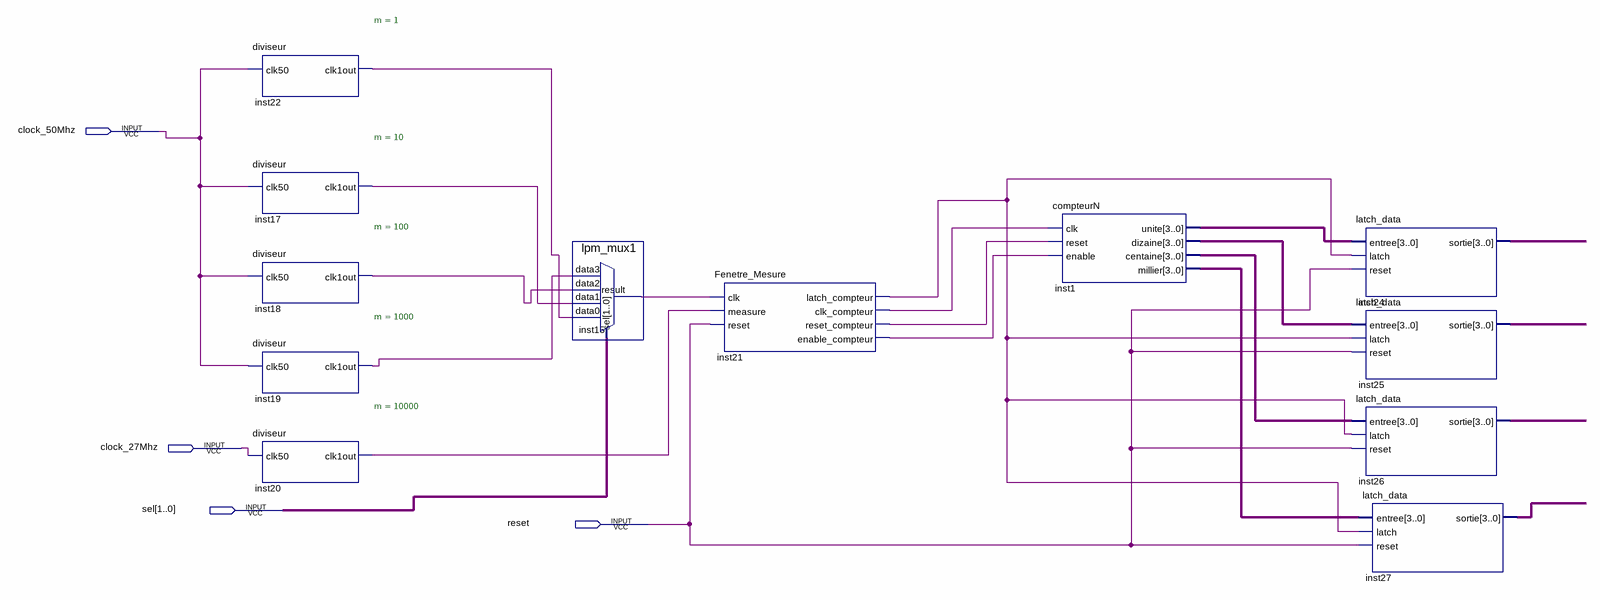
[diagram p0: schematic sheet]
// Quartus schematic TP_Schema.bdf as structural Verilog: 12 symbols, 4 pins
module TP_Schema (
  input  clock_50Mhz,
  input  clock_27Mhz,
  input  [1:0] sel,
  input  reset
);

  wire inst15_result, inst17_clk1out, inst18_clk1out, inst19_clk1out, inst20_clk1out, inst21_clk_compteur,
       inst21_enable_compteur, inst21_latch_compteur, inst21_reset_compteur, inst22_clk1out;
  wire [3:0] inst1_centaine, inst1_dizaine, inst1_millier, inst1_unite, inst24_sortie, inst25_sortie,
       inst26_sortie, inst27_sortie;

  diviseur #(.m(1)) inst22 (.clk50(clock_50Mhz), .clk1out(inst22_clk1out));
  diviseur #(.m(10)) inst17 (.clk50(clock_50Mhz), .clk1out(inst17_clk1out));
  diviseur #(.m(100)) inst18 (.clk50(clock_50Mhz), .clk1out(inst18_clk1out));
  diviseur #(.m(1000)) inst19 (.clk50(clock_50Mhz), .clk1out(inst19_clk1out));
  diviseur #(.m(10000)) inst20 (.clk50(clock_27Mhz), .clk1out(inst20_clk1out));
  lpm_mux1 inst15 (
    .data3(inst19_clk1out), .data2(inst18_clk1out), .data1(inst17_clk1out), .data0(inst22_clk1out),
    .sel(sel), .result(inst15_result));
  Fenetre_Mesure inst21 (
    .clk(inst15_result), .measure(inst20_clk1out), .reset(reset), .latch_compteur(inst21_latch_compteur),
    .clk_compteur(inst21_clk_compteur), .reset_compteur(inst21_reset_compteur),
    .enable_compteur(inst21_enable_compteur));
  compteurN inst1 (
    .clk(inst21_clk_compteur), .enable(inst21_enable_compteur), .reset(inst21_reset_compteur),
    .centaine(inst1_centaine), .dizaine(inst1_dizaine), .millier(inst1_millier), .unite(inst1_unite));
  latch_data inst24 (.entree(inst1_unite), .latch(inst21_latch_compteur), .reset(reset), .sortie(inst24_sortie));
  latch_data inst25 (.entree(inst1_dizaine), .latch(inst21_latch_compteur), .reset(reset), .sortie(inst25_sortie));
  latch_data inst26 (.entree(inst1_centaine), .latch(inst21_latch_compteur), .reset(reset), .sortie(inst26_sortie));
  latch_data inst27 (.entree(inst1_millier), .latch(inst21_latch_compteur), .reset(reset), .sortie(inst27_sortie));
endmodule
